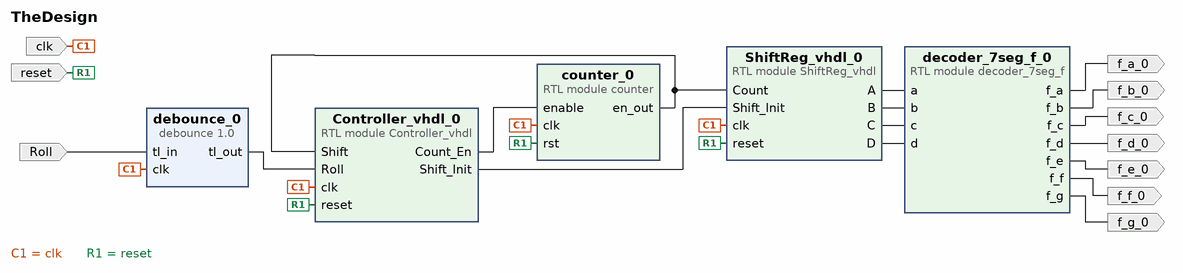
[diagram p0: block diagram of the top level]
# Vivado block design TheDesign, xc7a35tcpg236-1, Vivado 2018.3
create_bd_design TheDesign

create_bd_port -dir I Roll
create_bd_port -dir I clk
create_bd_port -dir I -type rst reset
set_property -dict {CONFIG.POLARITY ACTIVE_HIGH} [get_bd_ports reset]
create_bd_port -dir O f_a_0
create_bd_port -dir O f_b_0
create_bd_port -dir O f_c_0
create_bd_port -dir O f_d_0
create_bd_port -dir O f_e_0
create_bd_port -dir O f_f_0
create_bd_port -dir O f_g_0

create_bd_cell -type ip -vlnv FIT:user:debounce:1.0 debounce_0
create_bd_cell -type module -reference counter counter_0
create_bd_cell -type module -reference Controller_vhdl Controller_vhdl_0
create_bd_cell -type module -reference ShiftReg_vhdl ShiftReg_vhdl_0
create_bd_cell -type module -reference decoder_7seg_f decoder_7seg_f_0

# ---- connections ----

connect_bd_net -net clk_0_1 [get_bd_ports clk] \
  [get_bd_pins debounce_0/clk] [get_bd_pins counter_0/clk] [get_bd_pins Controller_vhdl_0/clk] \
  [get_bd_pins ShiftReg_vhdl_0/clk]
connect_bd_net [get_bd_ports reset] [get_bd_pins counter_0/rst] [get_bd_pins Controller_vhdl_0/reset] [get_bd_pins ShiftReg_vhdl_0/reset]
connect_bd_net [get_bd_pins counter_0/en_out] [get_bd_pins Controller_vhdl_0/Shift] [get_bd_pins ShiftReg_vhdl_0/Count]
connect_bd_net [get_bd_pins Controller_vhdl_0/Shift_Init] [get_bd_pins ShiftReg_vhdl_0/Shift_Init]
connect_bd_net [get_bd_pins Controller_vhdl_0/Count_En] [get_bd_pins counter_0/enable]
connect_bd_net [get_bd_pins ShiftReg_vhdl_0/A] [get_bd_pins decoder_7seg_f_0/a]
connect_bd_net [get_bd_pins ShiftReg_vhdl_0/B] [get_bd_pins decoder_7seg_f_0/b]
connect_bd_net [get_bd_pins ShiftReg_vhdl_0/C] [get_bd_pins decoder_7seg_f_0/c]
connect_bd_net [get_bd_pins ShiftReg_vhdl_0/D] [get_bd_pins decoder_7seg_f_0/d]
connect_bd_net [get_bd_pins decoder_7seg_f_0/f_a] [get_bd_ports f_a_0]
connect_bd_net [get_bd_pins decoder_7seg_f_0/f_b] [get_bd_ports f_b_0]
connect_bd_net [get_bd_pins decoder_7seg_f_0/f_c] [get_bd_ports f_c_0]
connect_bd_net [get_bd_pins decoder_7seg_f_0/f_d] [get_bd_ports f_d_0]
connect_bd_net [get_bd_pins decoder_7seg_f_0/f_e] [get_bd_ports f_e_0]
connect_bd_net [get_bd_pins decoder_7seg_f_0/f_f] [get_bd_ports f_f_0]
connect_bd_net [get_bd_pins decoder_7seg_f_0/f_g] [get_bd_ports f_g_0]
connect_bd_net [get_bd_ports Roll] [get_bd_pins debounce_0/tl_in]
connect_bd_net [get_bd_pins debounce_0/tl_out] [get_bd_pins Controller_vhdl_0/Roll]

validate_bd_design
save_bd_design
